# EAGLE design RPI_SmartServo_th_v2 (EAGLE 7.5.0)
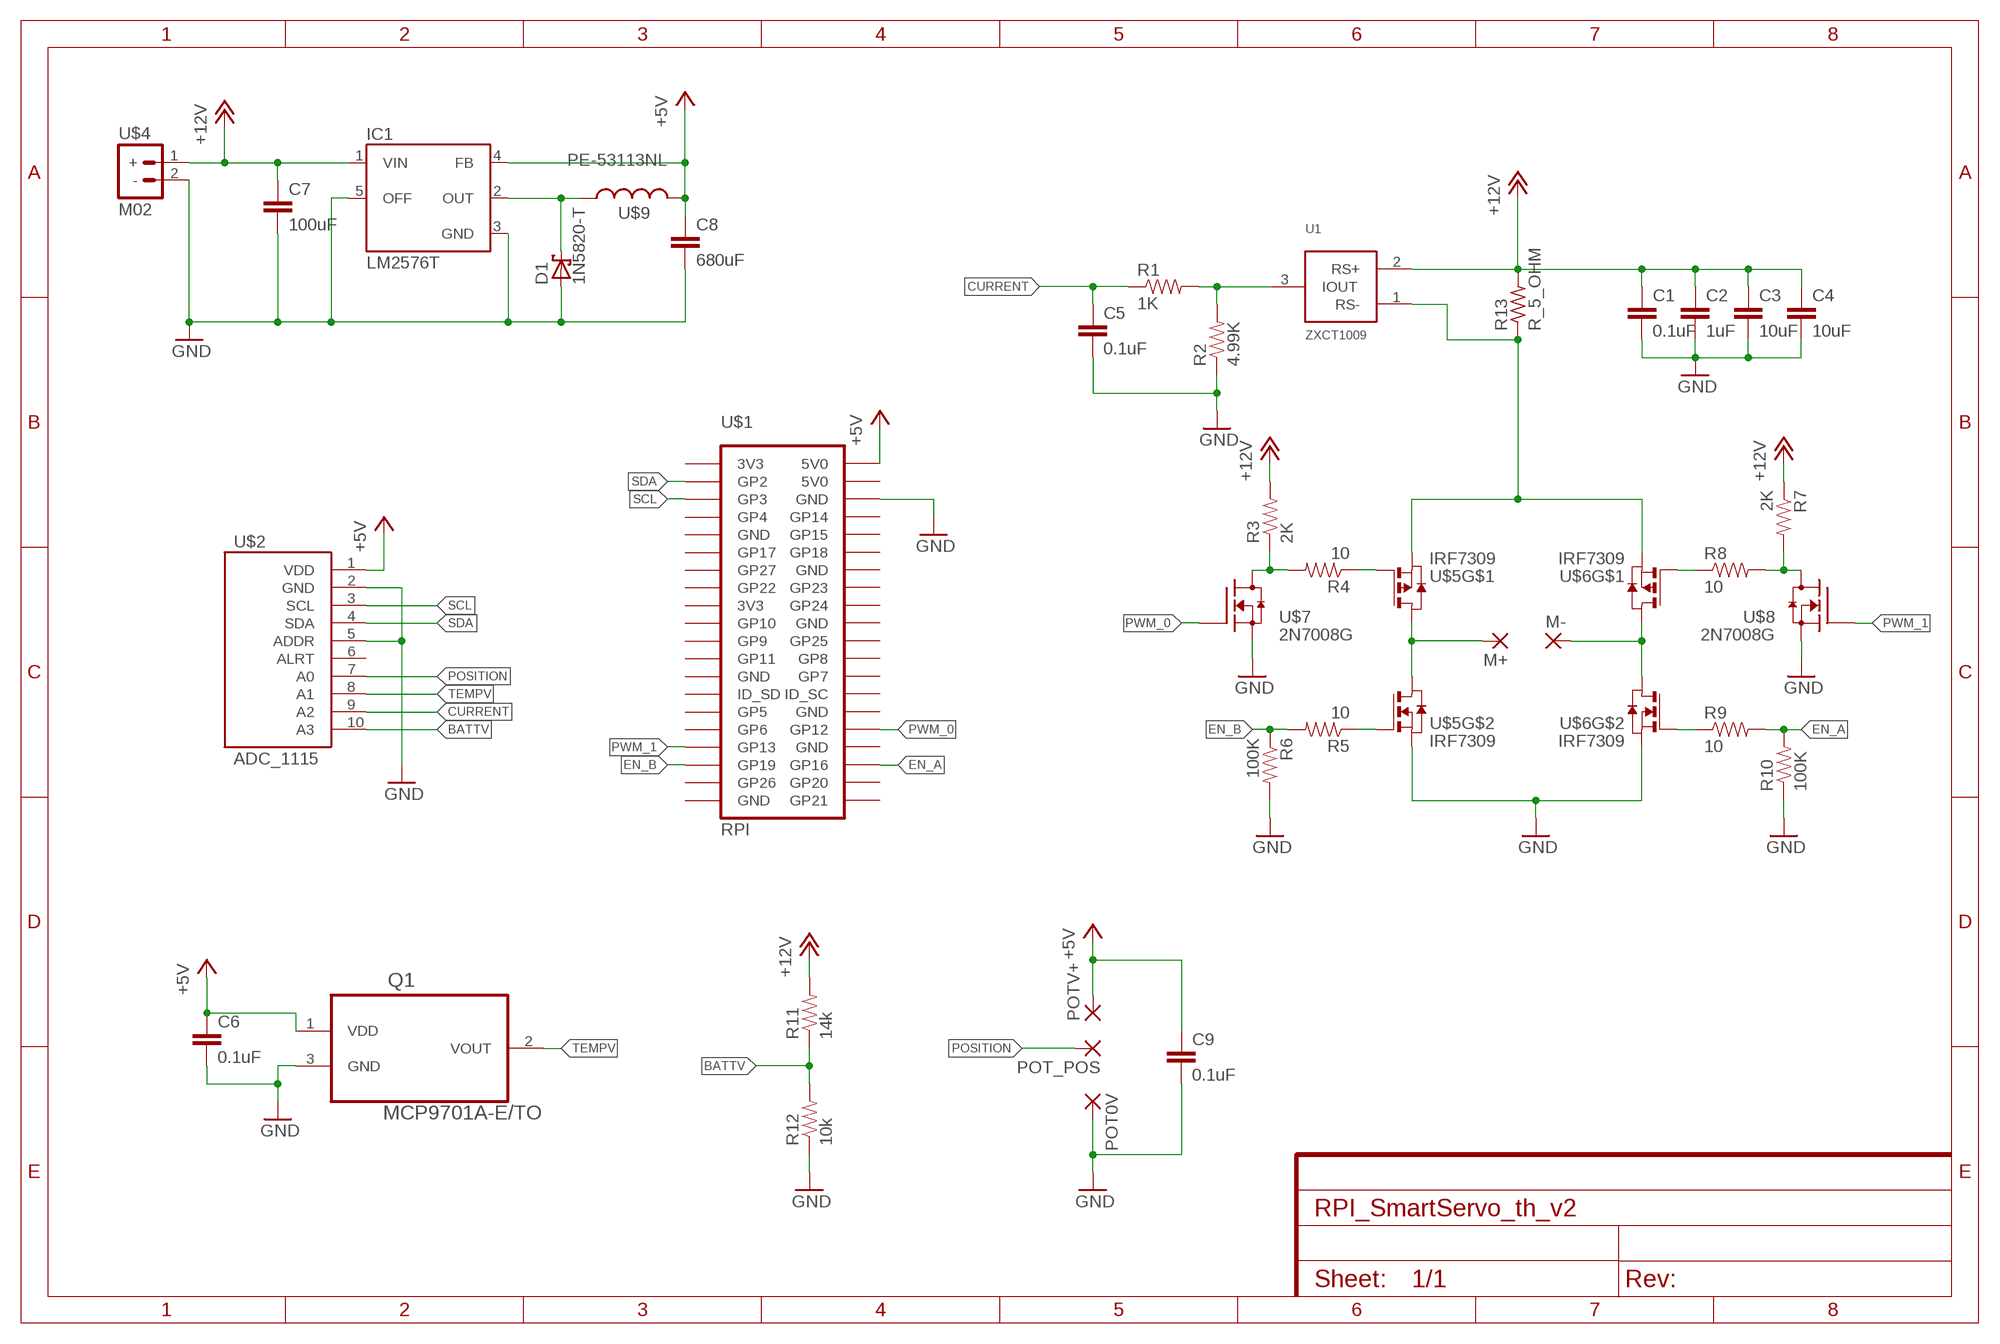
[diagram p0: schematic, sheet 1]

## Parts
C1  0.1uF  C-EU025-025X050  [C025-025X050]
C2  1uF  C-EU025-025X050  [C025-025X050]
C3  10uF  C-EU025-025X050  [C025-025X050]
C4  10uF  C-EU025-025X050  [C025-025X050]
C5  0.1uF  C-EU025-025X050  [C025-025X050]
C6  0.1uF  C-EU025-025X050  [C025-025X050]
C7  100uF  C-EU025-025X050  [C025-025X050]
C8  680uF  C-EU025-025X050  [C025-025X050]
C9  0.1uF  C-EU025-025X050  [C025-025X050]
D1  1N5820-T  SCHOTTKY-DIODEC4111-15  [C4111-15]
IC1  LM2576T  [TO220-5]
M+  1,6/0,9  [1,6/0,9]
M-  1,6/0,9  [1,6/0,9]
POT0V  1,6/0,9  [1,6/0,9]
POT_POS  1,6/0,9  [1,6/0,9]
POTV+  1,6/0,9  [1,6/0,9]
Q1  MCP9701A-E/TO  [TO127P254X533-3]
R1  1K  RESISTORPTH-1/4W  [AXIAL-0.4]
R2  4.99K  RESISTORPTH-1/4W  [AXIAL-0.4]
R3  2K  RESISTORPTH-1/4W  [AXIAL-0.4]
R4  10  RESISTORPTH-1/4W  [AXIAL-0.4]
R5  10  RESISTORPTH-1/4W  [AXIAL-0.4]
R6  100K  RESISTORPTH-1/4W  [AXIAL-0.4]
R7  2K  RESISTORPTH-1/4W  [AXIAL-0.4]
R8  10  RESISTORPTH-1/4W  [AXIAL-0.4]
R9  10  RESISTORPTH-1/4W  [AXIAL-0.4]
R10  100K  RESISTORPTH-1/4W  [AXIAL-0.4]
R11  14k  RESISTORPTH-1/4W  [AXIAL-0.4]
R12  10k  RESISTORPTH-1/4W  [AXIAL-0.4]
R13  R_5_OHM  [0922/22]
U1  ZXCT1009  [SOT23]
U$1  RPI  [2X20]
U$2  ADC_1115  [1X10]
U$4  M02  [1X02]
U$5  IRF7309  [SO8]
U$6  IRF7309  [SO8]
U$7  2N7008G  [TO-92]
U$8  2N7008G  [TO-92]
U$9  PE-53113NL  [KM-4]

## Nets
+5V: C6.1 C8.1 C9.1 IC1.4(FB) POTV+.1(P) Q1.1(VDD) U$1.2(5V0) U$2.1(VDD) U$9.P$2
+12V: C1.1 C2.1 C3.1 C4.1 C7.1 IC1.1(VIN) R3.P$2 R7.P$1 R11.P$2 R13.2 U1.2(RS+) U$4.1(+)
BATTV: R11.P$1 R12.P$2 U$2.10(A3)
CURRENT: C5.1 R1.P$1 U$2.9(A2)
EN_A: R9.P$2 R10.P$2 U$1.36(GP16)
EN_B: R5.P$2 R6.P$1 U$1.35(GP19)
GND: C1.2 C2.2 C3.2 C4.2 C5.2 C6.2 C7.2 C8.2 C9.2 D1.A IC1.3(GND) IC1.5(OFF) POT0V.1(P) Q1.3(GND) R2.P$1 R6.P$2 R10.P$1 R12.P$1 U$1.6(GND) U$2.2(GND) U$2.5(ADDR) U$4.2(-) U$5.1(S) U$6.1(S) U$7.1(S) U$8.1(S)
N$1: R1.P$2 R2.P$2 U1.3(IOUT)
N$4: M+.1(P) U$5.5(D) U$5.6(D) U$5.7(D) U$5.8(D)
N$5: R5.P$1 U$5.2(G)
N$6: R4.P$1 U$5.4(G)
N$7: M-.1(P) U$6.5(D) U$6.6(D) U$6.7(D) U$6.8(D)
N$8: R9.P$1 U$6.2(G)
N$9: R8.P$1 U$6.4(G)
N$10: D1.C IC1.2(OUT) U$9.P$1
N$12: R13.1 U1.1(RS-) U$5.3(S) U$6.3(S)
N$18: R3.P$1 R4.P$2 U$7.3(D)
N$21: R7.P$2 R8.P$2 U$8.3(D)
POSITION: POT_POS.1(P) U$2.7(A0)
PWM_0: U$1.32(GP12) U$7.2(G)
PWM_1: U$1.33(GP13) U$8.2(G)
SCL: U$1.5(GP3) U$2.3(SCL)
SDA: U$1.3(GP2) U$2.4(SDA)
TEMPV: Q1.2(VOUT) U$2.8(A1)
Unconnected: U$1.1(3V3) U$1.4(5V0) U$1.7(GP4) U$1.8(GP14) U$1.9(GND) U$1.10(GP15) U$1.11(GP17) U$1.12(GP18) U$1.13(GP27) U$1.14(GND) U$1.15(GP22) U$1.16(GP23) U$1.17(3V3) U$1.18(GP24) U$1.19(GP10) U$1.20(GND) U$1.21(GP9) U$1.22(GP25) U$1.23(GP11) U$1.24(GP8) U$1.25(GND) U$1.26(GP7) U$1.27(ID_SD) U$1.28(ID_SC) U$1.29(GP5) U$1.30(GND) U$1.31(GP6) U$1.34(GND) U$1.37(GP26) U$1.38(GP20) U$1.39(GND) U$1.40(GP21) U$2.6(ALRT)

## Library data of the parts
C1-C9 = rcl:C-EU: CAPACITOR, European symbol
D1 = adafruit:SCHOTTKY-DIODE: Schottky Diode
IC1 = v-reg-3:LM2576: National Semiconductor <http://www.national.com> 3.0A "Simple Switcher"(c) 52kHz, Vout 1.23-37V (HV: 57V), Vin 40V (HV: 60V), 50µA standby current
M+ M- POT0V POT_POS POTV+ = wirepad:1,6/0,9: THROUGH-HOLE PAD
Q1 = 00LibreriaErle:MCP9701A-E/TO: THERMISTOR, LINEAR 19, 5MV/C; MPN: MCP9701A-E/TO; OC_FARNELL: 1439484; OC_NEWARK: 17M0680; PACKAGE: TO-92-3; SUPPLIER: Microchip
R1-R12 = SparkFun-Resistors:RESISTOR: Resistor Basic schematic elements and footprints for 0603, 1206, and PTH resistors.
R13 = 00LibreriaErle:R_5_OHM
U1 = 00LibreriaErle:ZXCT1009: ZXCT1009 Current Monitor (current output) http://www.diodes.com/zetex/_pdfs/3.0/pdf/ZXCT1009.pdf
U$1 = 00LibreriaErle:RPI: RPI pin header
U$2 = 00LibreriaErle:ADC_1115: ADC_1115 pin header for breakout board
U$4 = 00LibreriaErle:M02
U$5 U$6 = 00LibreriaErle:IRF7309: IRF7309 PN MOSFET
U$7 U$8 = 00LibreriaErle:2N7008G: 2N7008-G-ND THROUGH HOLE DEVICE
U$9 = 00LibreriaErle:PE-53113NL

## Board
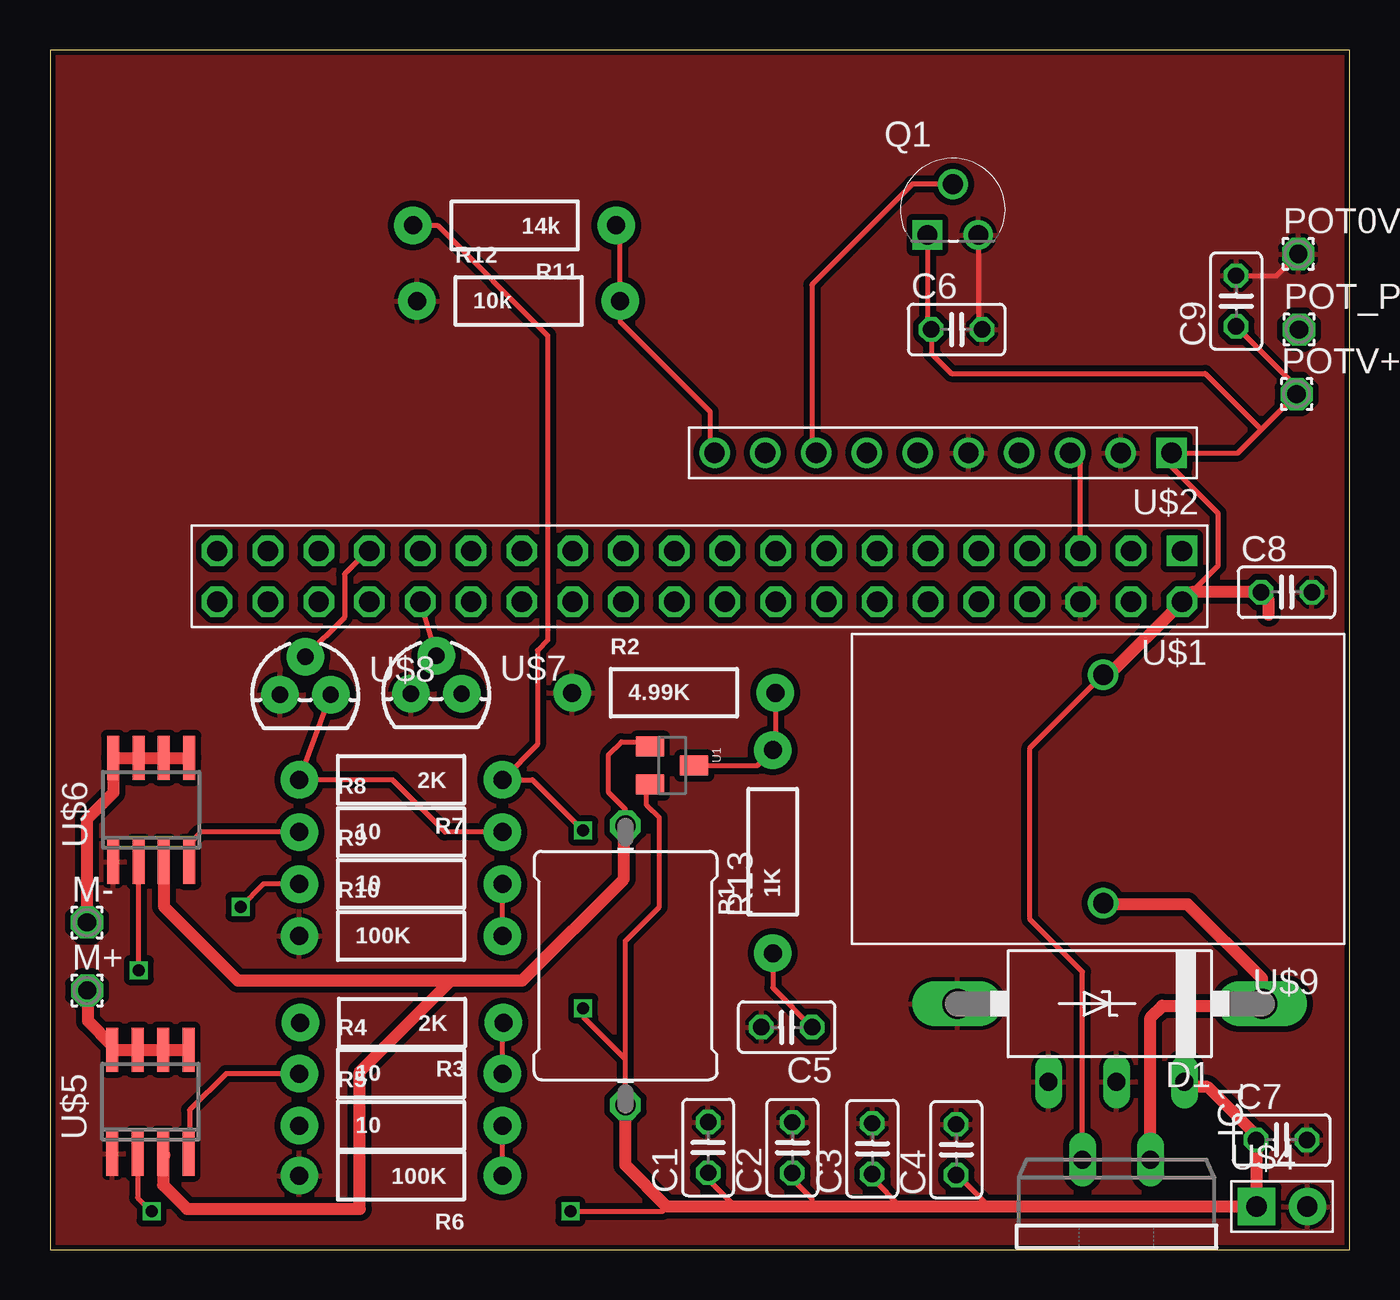
[diagram p1: board, top side]
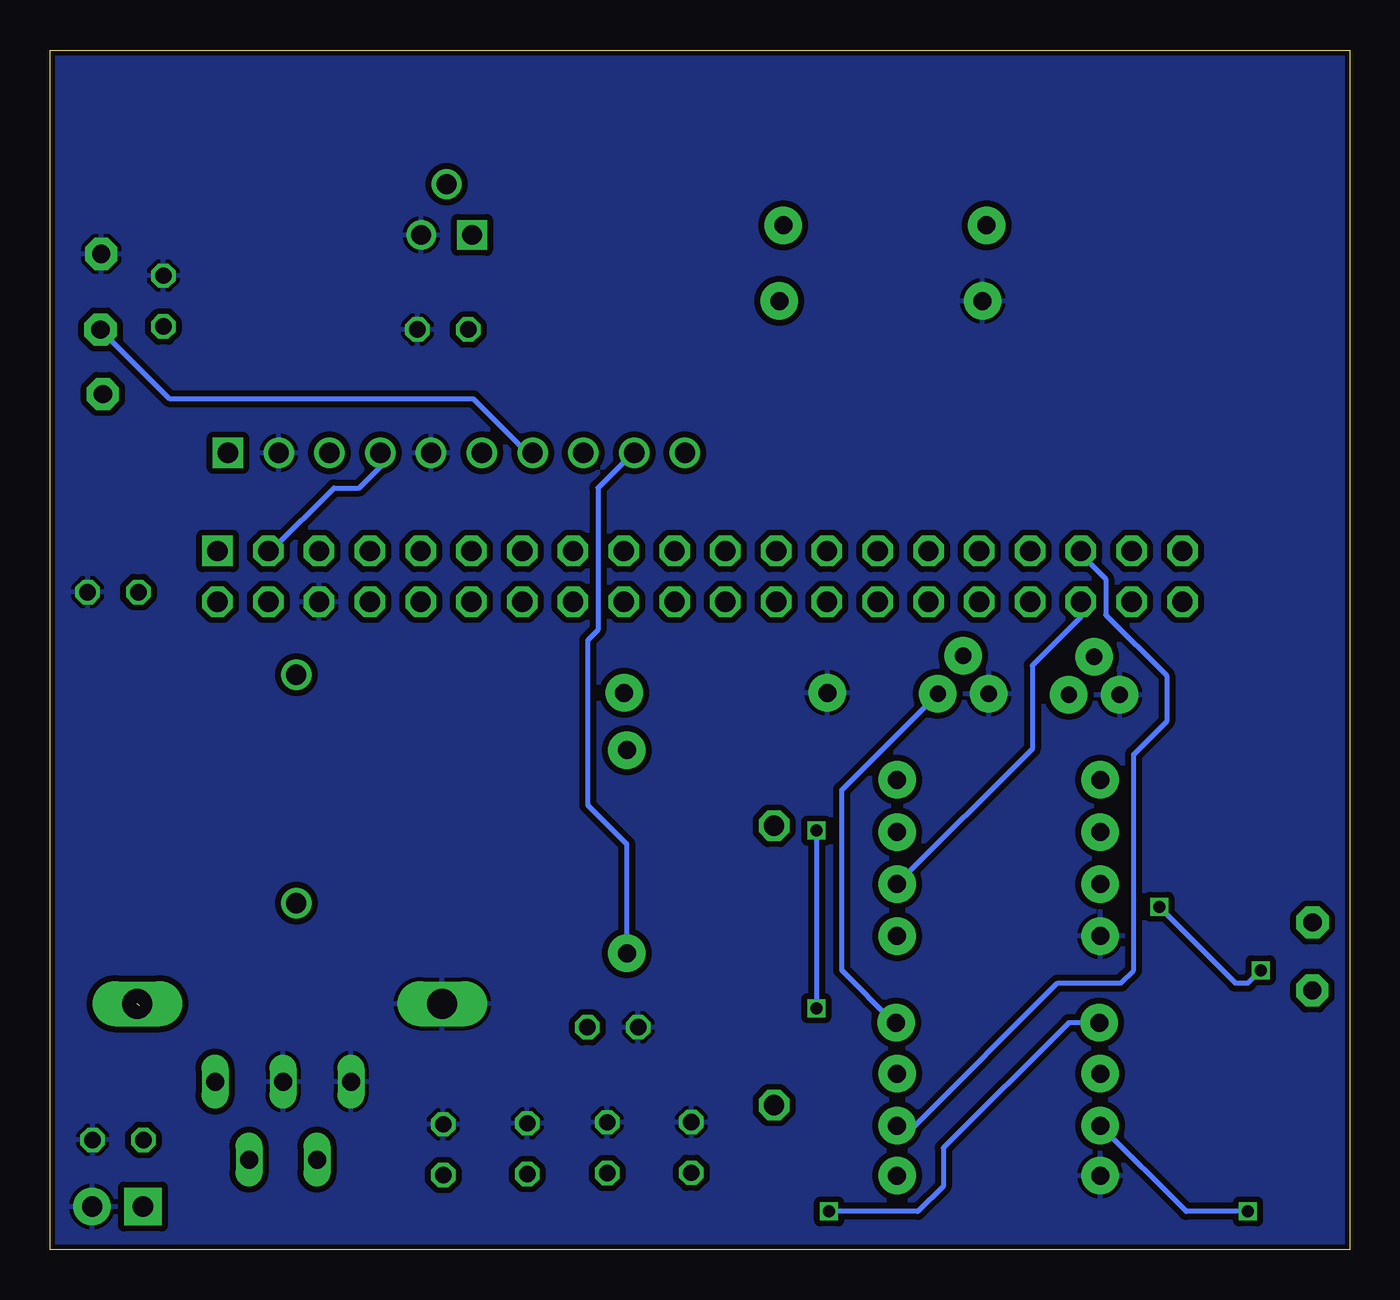
[diagram p2: board, bottom side, seen from below]

Size 65 x 60 mm. Coordinates in mm from the lower left corner, seen from the top.
Outline: 0,0 65,0 65,60 0,60 0,0
Copper layers (1*16): Top 0.035mm / dielectric 1.55mm / Bottom 0.035mm
Design rules "PCB_gprs": minimum track width 0.15mm, minimum drill 0.35mm, track to track 0.3mm, track to pad 0.3mm, pad to pad 0.3mm, via to via 0.3mm, smd to smd 0mil, copper to edge 0.25mm, drill to drill 0.35mm, minimum pad ring 0.175mm, minimum via ring 0.125mm, stop-mask expansion 0mil, vias tented up to drill 0.45mm, thermal gap 0.2mm

### Footprints (pad centres in the part's own frame; a part is rotated, then mirrored left to right if it is on the bottom)
C025-025X050 = drill 0.813 octagon: 1 -1.27,0; 2 1.27,0
C4111-15 = drill 1.499 long: A 7.62,0; C -7.62,0
TO220-5 = drill 0.9 long: 1 -3.4,-8.4; 2 -1.7,-4.5; 3 0,-8.4; 4 1.7,-4.5; 5 3.4,-8.4
1,6/0,9 = drill 0.914 pad 1.6 octagon: 1 0,0
TO127P254X533-3 = drill 0.991 square: 1 -2.54,-2.54 | drill 0.991: 2 -1.27,0; 3 0,-2.54
AXIAL-0.4 = drill 0.9 pad 1.88: P$1 -5.08,0; P$2 5.08,0
0922/22 = drill 1.016 octagon: 1 -7.62,0; 2 6.35,0
SOT23 = smd 1 x 1.4: 1 -0.95,-1.1; 2 0.95,-1.1; 3 0,1.1
2X20 = drill 1.016 square: 1 -24.13,-1.27 | drill 1.016 octagon: 2 -24.13,1.27; 3 -21.59,-1.27; 4 -21.59,1.27; 5 -19.05,-1.27; 6 -19.05,1.27; 7 -16.51,-1.27; 8 -16.51,1.27; 9 -13.97,-1.27; 10 -13.97,1.27; 11 -11.43,-1.27; 12 -11.43,1.27; 13 -8.89,-1.27; 14 -8.89,1.27; 15 -6.35,-1.27; 16 -6.35,1.27; 17 -3.81,-1.27; 18 -3.81,1.27; 19 -1.27,-1.27; 20 -1.27,1.27; 21 1.27,-1.27; 22 1.27,1.27; 23 3.81,-1.27; 24 3.81,1.27; 25 6.35,-1.27; 26 6.35,1.27; 27 8.89,-1.27; 28 8.89,1.27; 29 11.43,-1.27; 30 11.43,1.27; 31 13.97,-1.27; 32 13.97,1.27; 33 16.51,-1.27; 34 16.51,1.27; 35 19.05,-1.27; 36 19.05,1.27; 37 21.59,-1.27; 38 21.59,1.27; 39 24.13,-1.27; 40 24.13,1.27
1X10 = drill 1.016 square: 1 -11.43,0 | drill 1.016: 2 -8.89,0; 3 -6.35,0; 4 -3.81,0; 5 -1.27,0; 6 1.27,0; 7 3.81,0; 8 6.35,0; 9 8.89,0; 10 11.43,0
1X02 = drill 1.016 pad 1.88 square: 1 0,0 | drill 1.016 pad 1.88: 2 2.54,0
SO8 = smd 0.6 x 2.2: 1 -1.905,-2.6; 2 -0.635,-2.6; 3 0.635,-2.6; 4 1.905,-2.6; 5 1.905,2.6; 6 0.635,2.6; 7 -0.635,2.6; 8 -1.905,2.6
TO-92 = drill 0.813 pad 1.88: 1 -1.27,0; 2 0,1.905; 3 1.27,0
KM-4 = drill 1.016: P$1 12.065,-2.032; P$2 12.065,-13.462

### Placement (x,y rotation side)
C1  32.92,5.11 90 top
C2  37.13,5.09 90 top
C3  41.13,5.04 90 top
C4  45.33,5 90 top
C5  36.85,11.12 180 top
C6  45.35,46.02 0 top
C7  61.6,5.48 0 top
C8  61.85,32.88 0 top
C9  59.33,47.44 90 top
D1  53.01,12.29 180 top
IC1  53.34,0 180 top
M+  1.86,12.96 0 top
M-  1.85,16.36 0 top
POT0V  62.44,49.8 0 top
POT_POS  62.48,46.02 0 top
POTV+  62.35,42.79 0 top
Q1  46.43,53.29 0 top
R1  36.15,19.9 90 top
R2  31.2,27.85 0 top
R3  17.6,11.35 180 top
R4  17.55,8.8 0 top
R5  17.55,6.2 0 top
R6  17.55,3.7 180 top
R7  17.55,23.5 180 top
R8  17.55,20.88 0 top
R9  17.55,18.28 0 top
R10  17.55,15.68 0 top
R11  23.24,51.23 180 top
R12  23.44,47.44 0 top
R13  28.79,13.57 270 top
U1  31.12,24.21 270 top
U$1  32.49,33.67 180 top
U$2  44.67,39.85 180 top
U$4  60.35,2.15 0 top
U$5  5.02,7.39 0 top
U$6  5.06,21.99 0 top
U$7  19.32,27.8 0 top
U$8  12.77,27.75 0 top
U$9  64.75,15.29 180 top

### Tracks (layer width: path | path; a pad name or v marks a point on that pad's centre or on a via)
+5V
  Top 0.254: Q1.1 43.89,46.21 C6.1 44.08,44.82 45.09,43.81 57.78,43.81 60.58,41.02 | C9.1 62.35,43.15 POTV+.1 60.58,41.02 | 57.1,32.88 58.42,34.2 58.42,36.83 56.1,39.15 U$2.1 59.41,39.85 60.58,41.02 | IC1.4 51.64,13.89 49.02,16.51 49.02,25.09 U$9.P$2
  Top 0.61: 60.96,31.75 60.96,32.5 C8.1 57.1,32.88 U$1.2 52.97,28.75 U$9.P$2
+12V  (via drill 0.6)
  Top 0.254: C1.1 32.92,3.52 34.29,2.15 | C2.1 37.13,3.51 38.1,2.54 38.1,2.15 | C3.1 41.13,3.56 42.55,2.15 | C4.1 45.41,3.73 46.99,2.15 | R13.2 28.79,9.53 | 28.79,9.53 28.79,15.45 30.48,17.14 30.48,21.59 29.84,22.23 29.84,23.09 U1.2 | v26.67,20.95 24.12,23.5 R7.P$1 24.38,25.25 24.38,29.97 24.89,30.48 24.89,45.72 19.39,51.23 R11.P$2 | v26.67,12.06 26.67,11.64 28.79,9.53 | v26.04,1.91 30.62,1.91 30.87,2.15
  Top 0.61: R13.2 28.79,4.24 30.87,2.15 34.29,2.15 38.1,2.15 42.55,2.15 46.99,2.15 U$4.1 60.35,5.46 C7.1 60.33,5.71 57.91,8.13 57.01,8.13 IC1.1
  Bottom 0.254: v26.67,20.95 v26.67,12.06 | R3.P$2 14.05,11.35 20.32,5.08 20.32,3.17 21.59,1.91 v26.04,1.91
BATTV
  Top 0.254: 33.09,40.01 U$2.10 33.02,40.07 33.02,41.91 28.52,46.41 R12.P$2 28.52,51.02 R11.P$1
CURRENT
  Top 0.254: R1.P$1 36.15,13.09 C5.1
  Bottom 0.254: R1.P$1 36.15,20.27 38.1,22.23 38.1,30.48 37.59,30.99 37.59,38.1 35.84,39.85 U$2.9
EN_A
  Top 0.254: R10.P$2 R9.P$2
  Bottom 0.254: U$1.36 13.44,31.64 15.88,29.21 15.88,25.04 R9.P$2
EN_B
  Top 0.254: R6.P$1 R5.P$2
  Bottom 0.254: R5.P$2 21.74,6.2 14.61,13.34 11.43,13.34 10.79,13.97 10.79,24.77 9.14,26.42 9.14,28.7 12.19,31.75 12.19,33.53 13.44,34.78 U$1.35
GND
  Top 0.254: Q1.3 46.43,46.21 C6.2 | C9.2 61.34,48.71 POT0V.1
  pour Top: 0,59.69 64.77,59.69 64.77,58.42 64.77,0 0,0
  pour Bottom: 0,59.69 64.77,59.69 64.77,0 0,0
N$1
  Top 0.254: U1.3 35.38,24.21 R1.P$2 36.28,25.11 R2.P$2
N$4
  Top 0.61: M+.1 1.91,12.91 1.91,11.43 3.12,10.22 U$5.8 U$5.7 U$5.6 U$5.5
N$5  (via drill 0.6)
  Top 0.254: U$5.2 4.38,2.6 v5.08,1.91
  Bottom 0.254: v5.08,1.91 8.18,1.91 R5.P$1
N$6
  Top 0.254: R4.P$1 8.8,8.8 6.99,6.99 6.99,4.85 U$5.4
N$7
  Top 0.61: M-.1 1.85,21.54 3.17,22.86 3.17,24.57 U$6.8 U$6.7 U$6.6 U$6.5
N$8  (via drill 0.6)
  Top 0.254: R9.P$1 10.66,18.28 v9.53,17.14 | v4.45,13.97 4.45,19.37 U$6.2
  Bottom 0.254: v9.53,17.14 5.71,13.34 5.08,13.34 v4.45,13.97
N$9
  Top 0.254: R8.P$1 7.54,20.88 6.99,20.32 6.99,19.41 U$6.4
N$10  (1 unrouted)
  Top 0.61: IC1.2 55.04,11.61 55.63,12.19 60.52,12.19 | D1.C 60.63,13.54 56.9,17.27 52.73,17.27 U$9.P$1
N$12
  Top 0.254: R13.1 28.79,22.02 27.94,22.86 27.94,24.77 28.57,25.4 29.78,25.4 U1.1
  Top 0.61: 5.71,4.73 U$5.3 5.66,3.23 6.86,2.03 15.49,2.03 15.49,8.89 20.07,13.46 | U$6.3 5.7,17.16 9.4,13.46 20.07,13.46 | 20.07,13.46 23.62,13.46 28.7,18.54 28.7,21.11 R13.1
N$18
  Top 0.254: R4.P$2 22.63,11.3 R3.P$1
  Bottom 0.254: R3.P$1 22.78,11.35 25.4,13.97 25.4,22.99 U$7.3
N$21
  Top 0.254: R8.P$2 19.76,20.88 17.14,23.5 R7.P$2 U$8.3
POSITION
  Bottom 0.254: U$2.7 41.12,39.85 43.81,42.55 59.01,42.55 POT_POS.1
PWM_0
  Top 0.254: U$1.32 U$7.2
PWM_1
  Top 0.254: U$1.33 15.89,34.94 14.73,33.78 14.73,31.62 U$8.2
SCL
  Top 0.254: U$1.5 51.54,39.33 U$2.3
SDA
  Bottom 0.254: U$1.3 53.96,34.94 50.8,38.1 49.53,38.1 48.26,39.37 48.26,39.63 U$2.4
TEMPV
  Top 0.254: Q1.2 43.13,53.29 38.1,48.26 38.1,40.07 U$2.8